# Altium schematic sheet [03] - RS485.SchDoc
size A4
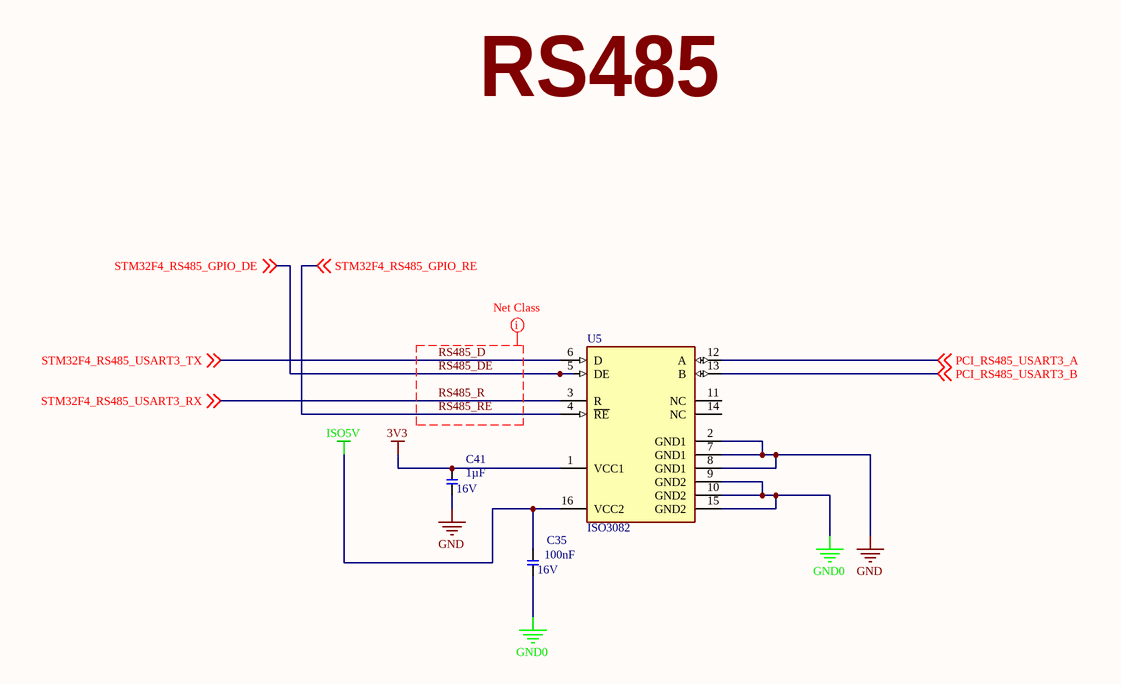
[diagram p0: [03] - RS485.SchDoc]

## Parts
C35  100nF  Voltage - Rated: 16V  [C0805]
C41  1µF  Voltage - Rated: 16V  [C0805]
U5  ISO3082  [DW16_L]

## Nets
3V3: C41.2 U5.1(VCC1)
GND: C41.1 U5.2(GND1) U5.7(GND1) U5.8(GND1)
GND0: C35.1 U5.9(GND2) U5.10(GND2) U5.15(GND2)
ISO5V: C35.2 U5.16(VCC2)
PCI_RS485_USART3_A: U5.12(A) ; off-sheet PCI_RS485_USART3_A
PCI_RS485_USART3_B: U5.13(B) ; off-sheet PCI_RS485_USART3_B
RS485_D: U5.6(D) ; off-sheet STM32F4_RS485_USART3_TX  [also labelled STM32F4_RS485_USART3_TX]
RS485_DE: U5.5(DE) ; off-sheet STM32F4_RS485_GPIO_DE  [also labelled STM32F4_RS485_GPIO_DE]
RS485_R: U5.3(R) ; off-sheet STM32F4_RS485_USART3_RX  [also labelled STM32F4_RS485_USART3_RX]
RS485_RE: U5.4(~{RE}) ; off-sheet STM32F4_RS485_GPIO_RE  [also labelled STM32F4_RS485_GPIO_RE]

Not connected (* = marked no-connect by the designer): U5 11(NC) 14(NC)

## Layout directives
net class RS485: RS485_D, RS485_DE, RS485_R, RS485_RE

## Notes on the sheet
- RS485

## Library data of the parts
C35 = C-100NF,16V,0805: AVX - 0805YA103JAT2A - CAP, MLCC, C0G/NP0, 10NF, 16V, 0805; Tolerance: ±5%; Temperature Coefficient: C0G, NP0; Supplier 1: Digi-Key; Manufacturer: AVX; Manufacturer Part Number: 0805YA103JAT2A; RoHS: YES; Stock 1: 28062; Pricing 1: 1=0.29, 10=0.204, 25=0.1668, 50=0.1424, 100=0.1221, 250=0.10176, 500=0.09158, 1000=0.07733 (USD); Capacitance: 100nF; Packaging: Cut Tape (CT); ComponentLink1URL: http://www.avx.com/docs/Catalogs/ccog.pdf; ComponentLink1Description: http://www.avx.com/docs/Catalogs/ccog.pdf; Supplier Part Number 1: 478-1334-1-ND; ComponentLink2URL: http://www.farnell.com/datasheets/1825494.pdf; ComponentLink2Description: http://www.farnell.com/datasheets/1825494.pdf; Category: Capacitors; Mounting Type: Surface Mount, MLCC; Operating Temperature: -55°C ~ 125°C; Applications: General Purpose; Ratings: -; Package / Case: 0805 (2012 Metric); Size / Dimension: 0.079" L x 0.049" W (2.01mm x 1.25mm); Height - Seated (Max): -; Thickness (Max): 0.037" (0.94mm); Lead Spacing: -; Features: -; Lead Style: -; ComponentLink3URL: http://datasheets.avx.com/C0GNP0-Dielectric.pdf; ComponentLink3Description: http://datasheets.avx.com/C0GNP0-Dielectric.pdf
C41 = C-1UF,16V,0805: AVX - 0805YC105KAT2A - CAP, MLCC, X7R, 1UF, 16V, 0805; Manufacturer: AVX Corporation; Tolerance: ±10%; Supplier 1: Digi-Key; Manufacturer Part Number: 0805YC105KAT2A; RoHS: RoHS Compliant; Stock 1: 76930; Pricing 1: 1=0.19, 10=0.132, 25=0.0964, 50=0.075, 100=0.0622, 250=0.05148, 500=0.04362, 1000=0.03611 (USD); ComponentLink1URL: http://datasheets.avx.com/X7RDielectric.pdf; ComponentLink1Description: http://datasheets.avx.com/X7RDielectric.pdf; Supplier Part Number 1: 478-5034-1-ND; Category: Capacitors; Packaging: Cut Tape (CT); Temperature Coefficient: X7R; Mounting Type: Surface Mount, MLCC; Operating Temperature: -55°C ~ 125°C; Applications: General Purpose; Ratings: -; Package / Case: 0805 (2012 Metric); Size / Dimension: 0.079" L x 0.049" W (2.01mm x 1.25mm); Height - Seated (Max): -; Thickness (Max): 0.055" (1.40mm); Lead Spacing: -; Features: -; Lead Style: -; Capacitance: 1µF
U5 = IC-ISO3082-SOIC-DW-16: DG ISO 2.5KV RS422/RS485 16SOIC; Manufacturer: Texas Instruments; Manufacturer Part Number: ISO3082DWR; Isolated Power: No; Number of Channels: 3; Inputs - Side 1/Side 2: 2/1; Channel Type: Unidirectional; Voltage - Isolation: 2500Vrms; Common Mode Transient Immunity (Min): 25kV/µs; Data Rate: 200kbps; Voltage - Supply: 3.15 V ~ 5.5 V, 4.5 V ~ 5.5 V; Supplier 1: Digi-Key; RoHS: RoHS Compliant; Stock 1: 9564; Pricing 1: 1=6.39, 10=5.733, 100=4.7034, 500=4.0014, 1000=2.925 (USD); ComponentLink1URL: http://www.ti.com/lit/ds/symlink/iso3082.pdf; ComponentLink1Description: http://www.ti.com/lit/ds/symlink/iso3082.pdf; Supplier Part Number 1: 296-37891-6-ND; Category: Isolators; Packaging: Digi-Reel®; Technology: Capacitive Coupling; Type: RS422, RS485; Propagation Delay tpLH / tpHL (Max): -; Pulse Width Distortion (Max): -; Rise / Fall Time (Typ): -; Operating Temperature: -40°C ~ 85°C; Package / Case: 16-SOIC (0.295", 7.50mm Width); Supplier Device Package: 16-SOIC